# Altium project elka2_tubes.PrjPcb
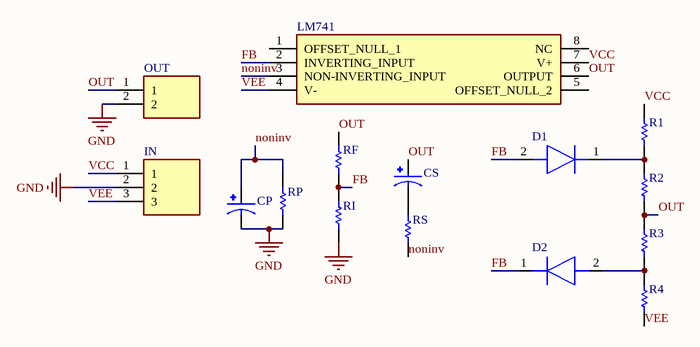
[diagram p0: elka2_tubes.SchDoc]
1 sheet, 15 parts. Net scope: global (net labels, ports and power ports of the same name join across sheets).
Board file: elka2_tubes.PcbDoc

## Sheet elka2_tubes.SchDoc
size A4; SheetNumber: 1; SheetTotal: 1

### Parts
CP  elco_kecil  [elco_kecil]  (value not drawn)
CS  elco_kecil  [elco_kecil]  (value not drawn)
D1  1N4007-E3_73  [DIOAD1405W86L465D235]  (value not drawn)
D2  1N4007-E3_73  [DIOAD1405W86L465D235]  (value not drawn)
IN  KF301-3P  [KF3013P]  (value not drawn)
LM741  LM741CN_NOPB-936607701  [DIP794W53P254L959H508Q8N]  (value not drawn)
OUT  KF301-2P  [KF3012P]  (value not drawn)
R1  Resistor 0.25W  [Resistor 0.25W]  (value not drawn)
R2  Resistor 0.25W  [Resistor 0.25W]  (value not drawn)
R3  Resistor 0.25W  [Resistor 0.25W]  (value not drawn)
R4  Resistor 0.25W  [Resistor 0.25W]  (value not drawn)
RF  Resistor 0.25W  [Resistor 0.25W]  (value not drawn)
RI  Resistor 0.25W  [Resistor 0.25W]  (value not drawn)
RP  Resistor 0.25W  [Resistor 0.25W]  (value not drawn)
RS  Resistor 0.25W  [Resistor 0.25W]  (value not drawn)

### Nets
GND: CP.N IN.2 OUT.2 RI.1 RP.1
FB: D1.2(A) D2.1(K) LM741.2(INVERTING_INPUT) RF.1 RI.2
noninv: CP.P LM741.3(NON-INVERTING_INPUT) RP.2 RS.1
OUT: CS.P LM741.6(OUTPUT) OUT.1 R2.1 R3.2 RF.2
VCC: IN.1 LM741.7(V+) R1.2
VEE: IN.3 LM741.4(V-) R4.1
NetCS_N: CS.N RS.2
NetD1_1: D1.1(K) R1.1 R2.2
NetD2_2: D2.2(A) R3.1 R4.2

Not connected (* = marked no-connect by the designer): LM741 1(OFFSET_NULL_1) 5(OFFSET_NULL_2) 8(NC)

### Library data of the parts
CP CS = elco_kecil: CAP ALUM 10UF 20% 25V RADIAL; MF: Panasonic; MP: EEA-GA1E100; Package: RADIAL-2 Panasonic; Price: None; Check_prices: https://www.snapeda.com/parts/EEA-GA1E100/Panasonic/view-part/2301584/?ref=eda; Value: *; SnapEDA_Link: https://www.snapeda.com/parts/EEA-GA1E100/Panasonic/view-part/2301584/?ref=snap; Availability: In Stock
D1 D2 = 1N4007-E3_73: Diode; Manufacturer_Name: Vishay; Manufacturer_Part_Number: 1N4007-E3/73; Datasheet Link: https://mouser.componentsearchengine.com/Datasheets/2/1N4007-E3_73.pdf; Mouser Part Number: 625-1N4007-E3/73; Mouser Price/Stock: https://www.mouser.co.uk/ProductDetail/Vishay-General-Semiconductor/1N4007-E3-73?qs=N4vtoAxH%2FSqT3Ng3e4K0Gw%3D%3D; Arrow Part Number: 1N4007-E3/73; Arrow Price/Stock: https://www.arrow.com/en/products/1n4007-e373/vishay?region=europe
IN = KF301-3P: Connector; Manufacturer_Name: Handson Technology; Datasheet Link: http://www.handsontec.com/dataspecs/terminal%20block-5mm.pdf; Height: 10mm; Manufacturer_Part_Number: KF301-3P
LM741 = LM741CN_NOPB-936607701: Integrated Circuit; Manufacturer_Name: Texas Instruments; Manufacturer_Part_Number: LM741CN/NOPB-936607701; Datasheet Link: https://www.arrow.com/en/products/lm741cnnopb-936607701/texas-instruments; Height: 5.08mm; Arrow Part Number: LM741CN/NOPB-936607701; Arrow Price/Stock: https://www.arrow.com/en/products/lm741cnnopb-936607701/texas-instruments
OUT = KF301-2P: Connector; Manufacturer_Name: Handson Technology; Datasheet Link: http://www.handsontec.com/dataspecs/terminal%20block-5mm.pdf; Height: 10mm; Manufacturer_Part_Number: KF301-2P